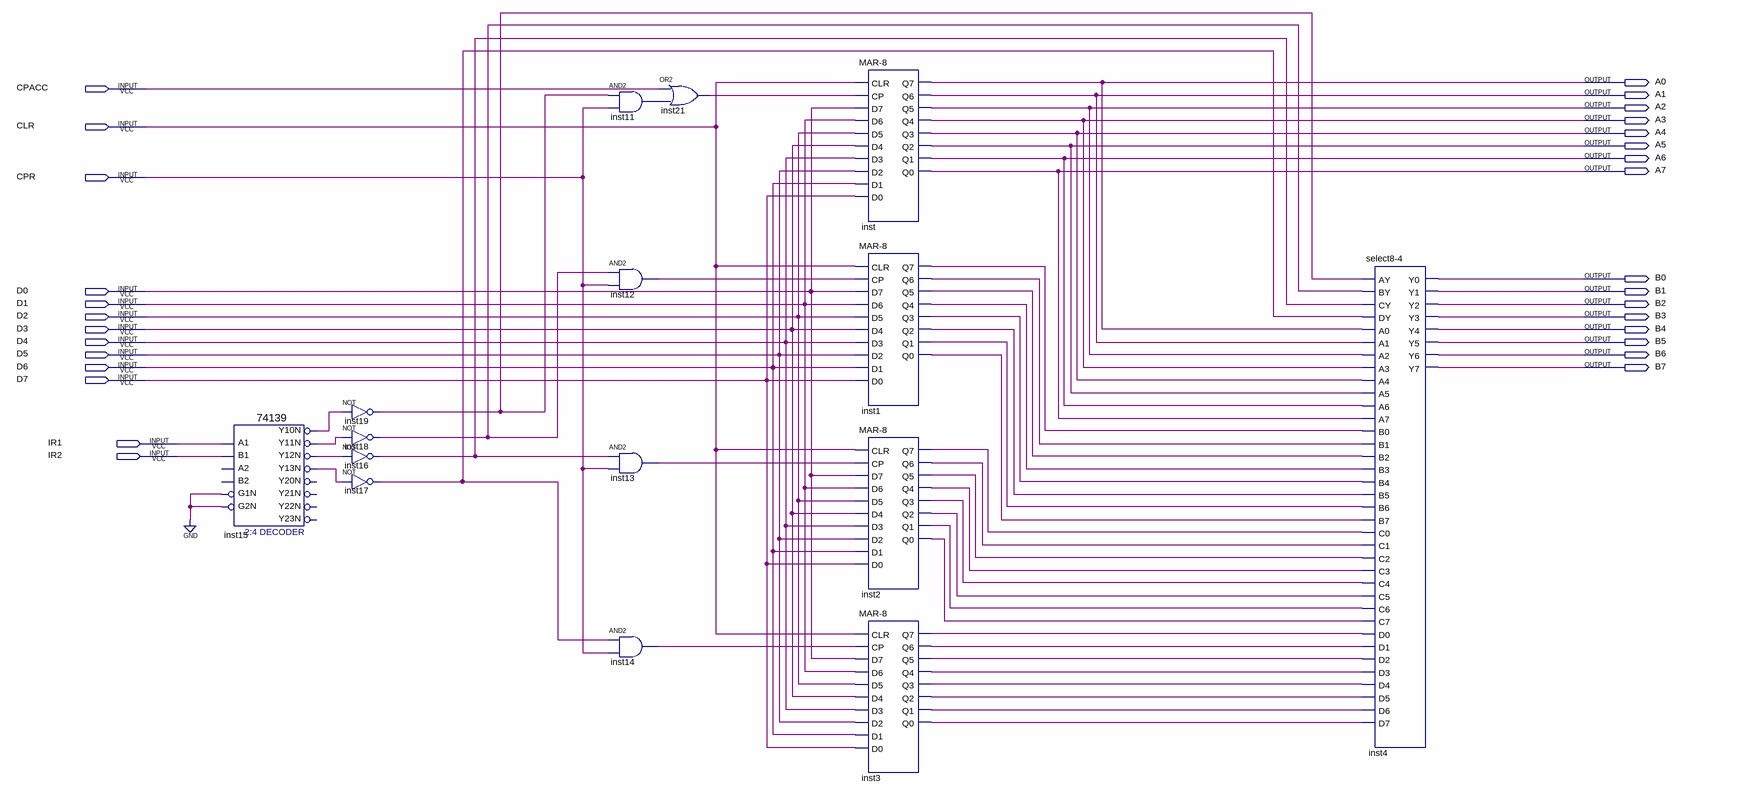
[diagram p0: schematic sheet]
// Quartus schematic register-group.bdf as structural Verilog: 15 symbols, 29 pins
module \register-group  (
  input  CPACC,
  input  CLR,
  input  CPR,
  input  D0,
  input  D1,
  input  D2,
  input  D3,
  input  D4,
  input  D5,
  input  D6,
  input  D7,
  input  IR1,
  input  IR2,
  output A0,
  output A1,
  output A2,
  output A3,
  output A4,
  output A5,
  output A6,
  output A7,
  output B0,
  output B1,
  output B2,
  output B3,
  output B4,
  output B5,
  output B6,
  output B7
);

  wire inst1_q0, inst1_q1, inst1_q2, inst1_q3, inst1_q4, inst1_q5, inst1_q6, inst1_q7, inst2_q0, inst2_q1,
       inst2_q2, inst2_q3, inst2_q4, inst2_q5, inst2_q6, inst2_q7, inst3_q0, inst3_q1, inst3_q2, inst3_q3,
       inst3_q4, inst3_q5, inst3_q6, inst3_q7, inst11_out, inst12_out, inst13_out, inst14_out, inst15_y10n,
       inst15_y11n, inst15_y12n, inst15_y13n, inst16_out, inst17_out, inst18_out, inst19_out, inst21_out;

  \74139  inst15 (
    .A1(IR1), .B1(IR2), .G1N(1'b0), .G2N(1'b0), .Y10N(inst15_y10n), .Y13N(inst15_y13n), .Y12N(inst15_y12n),
    .Y11N(inst15_y11n));  // open: A2, B2, Y20N, Y21N, Y22N, Y23N
  not inst19 (inst19_out, inst15_y10n);
  not inst18 (inst18_out, inst15_y11n);
  not inst16 (inst16_out, inst15_y12n);
  not inst17 (inst17_out, inst15_y13n);
  and inst11 (inst11_out, inst19_out, CPR);
  and inst12 (inst12_out, inst18_out, CPR);
  and inst13 (inst13_out, inst16_out, CPR);
  and inst14 (inst14_out, inst17_out, CPR);
  or inst21 (inst21_out, CPACC, inst11_out);
  \MAR-8  inst (
    .CLR(CLR), .CP(inst21_out), .D7(D0), .D6(D1), .D5(D2), .D4(D3), .D3(D4), .D2(D5), .D1(D6), .D0(D7),
    .Q7(A0), .Q6(A1), .Q5(A2), .Q4(A3), .Q3(A4), .Q2(A5), .Q1(A6), .Q0(A7));
  \MAR-8  inst1 (
    .CLR(CLR), .CP(inst12_out), .D7(D0), .D6(D1), .D5(D2), .D4(D3), .D3(D4), .D2(D5), .D1(D6), .D0(D7),
    .Q7(inst1_q7), .Q6(inst1_q6), .Q5(inst1_q5), .Q4(inst1_q4), .Q3(inst1_q3), .Q2(inst1_q2), .Q1(inst1_q1),
    .Q0(inst1_q0));
  \MAR-8  inst2 (
    .CLR(CLR), .CP(inst13_out), .D7(D0), .D6(D1), .D5(D2), .D4(D3), .D3(D4), .D2(D5), .D1(D6), .D0(D7),
    .Q7(inst2_q7), .Q6(inst2_q6), .Q5(inst2_q5), .Q4(inst2_q4), .Q3(inst2_q3), .Q2(inst2_q2), .Q1(inst2_q1),
    .Q0(inst2_q0));
  \MAR-8  inst3 (
    .CLR(CLR), .CP(inst14_out), .D7(D0), .D6(D1), .D5(D2), .D4(D3), .D3(D4), .D2(D5), .D1(D6), .D0(D7),
    .Q7(inst3_q7), .Q6(inst3_q6), .Q5(inst3_q5), .Q4(inst3_q4), .Q3(inst3_q3), .Q2(inst3_q2), .Q1(inst3_q1),
    .Q0(inst3_q0));
  \select8-4  inst4 (
    .AY(inst19_out), .BY(inst18_out), .CY(inst16_out), .DY(inst17_out), .A0(A0), .A1(A1), .A2(A2), .A3(A3),
    .A4(A4), .A5(A5), .A6(A6), .A7(A7), .B0(inst1_q7), .B1(inst1_q6), .B2(inst1_q5), .B3(inst1_q4),
    .B4(inst1_q3), .B5(inst1_q2), .B6(inst1_q1), .B7(inst1_q0), .C0(inst2_q7), .C1(inst2_q6), .C2(inst2_q5),
    .C3(inst2_q4), .C4(inst2_q3), .C5(inst2_q2), .C6(inst2_q1), .C7(inst2_q0), .D0(inst3_q7), .D1(inst3_q6),
    .D2(inst3_q5), .D3(inst3_q4), .D4(inst3_q3), .D5(inst3_q2), .D6(inst3_q1), .D7(inst3_q0), .Y0(B0),
    .Y1(B1), .Y2(B2), .Y3(B3), .Y4(B4), .Y5(B5), .Y6(B6), .Y7(B7));
endmodule
